# EAGLE design PCB-MicroKP01 (EAGLE 7.7.0)

## Sheet 1 of 2
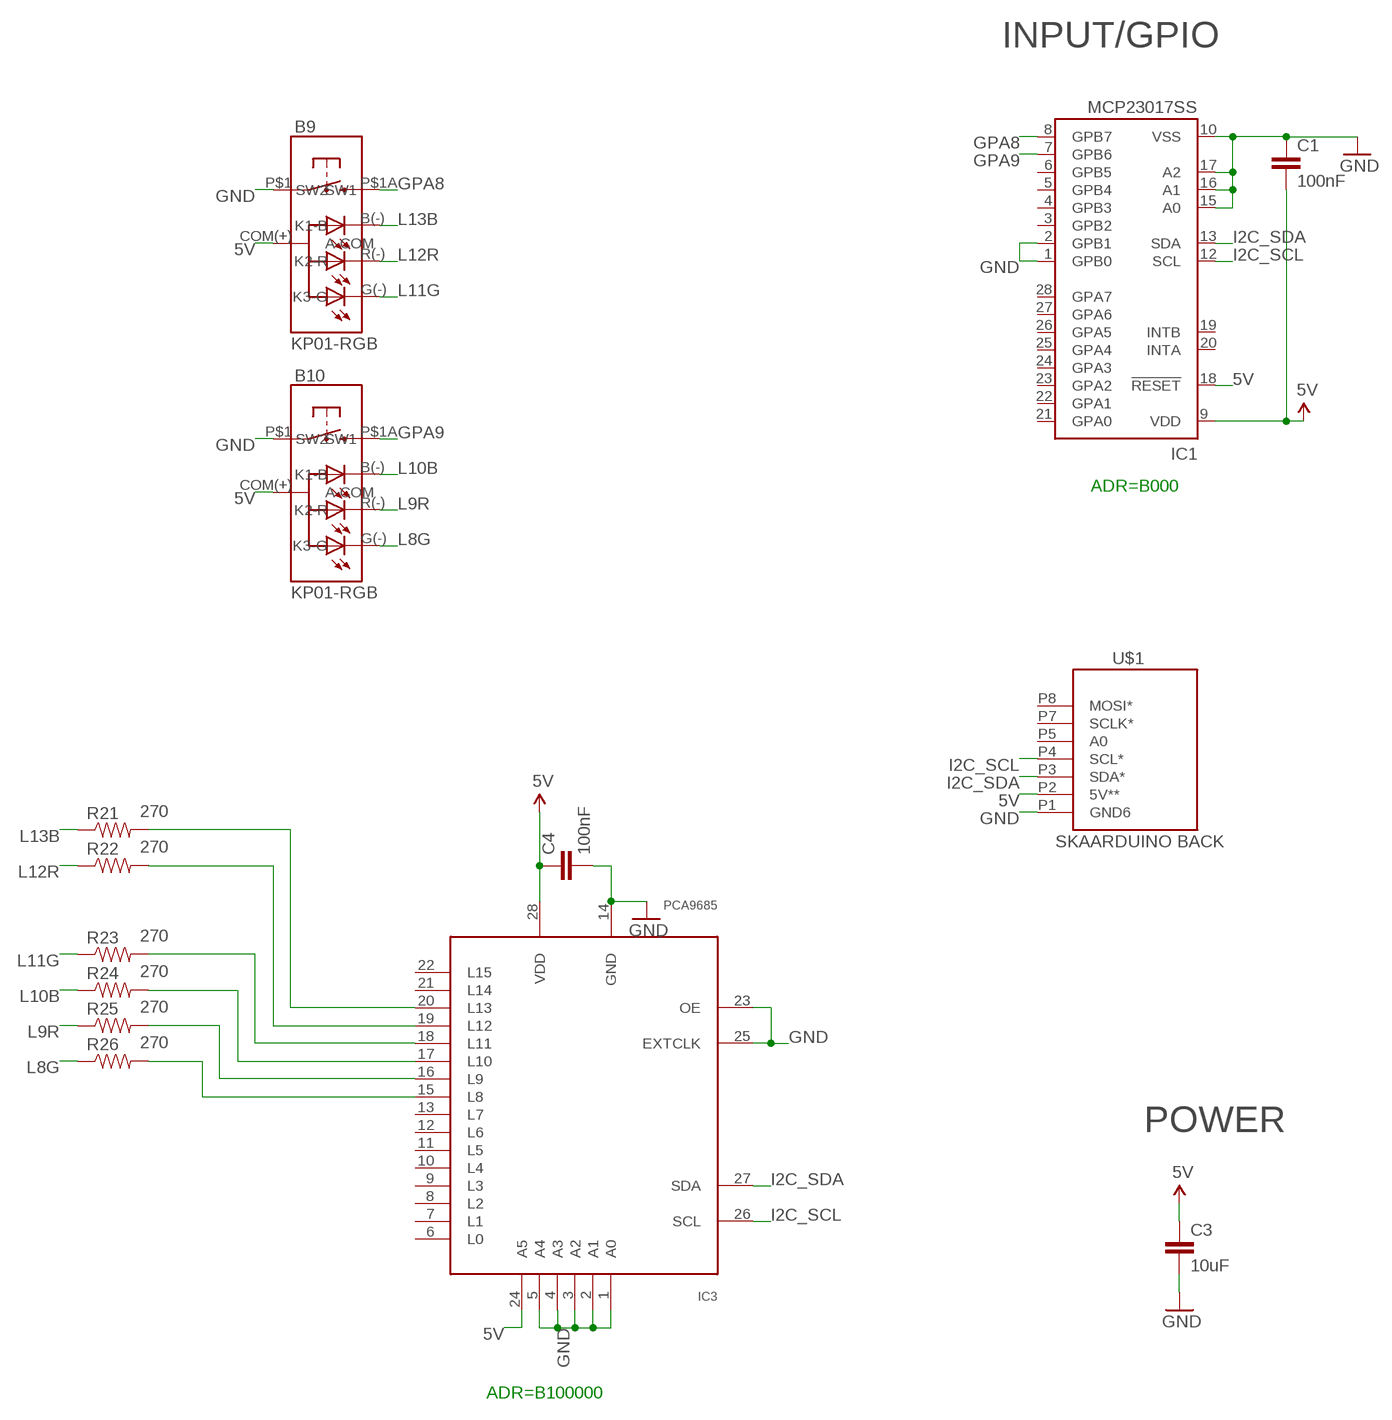
[diagram p0: schematic, sheet 1]

### Parts
B9  KP01-RGB  NKK-KP01  [NKK-KP01]
B10  KP01-RGB  NKK-KP01  [NKK-KP01]
C1  100nF  CAP0603-CAP  [0603-CAP]
C3  10uF  CAP0805  [0805]
C4  100nF  CAP0603-CAP  [0603-CAP]
IC1  MCP23017SS  [SSOP28]
IC3  PCA9685  [TSSOP28]
R21  270  RESISTOR0603-RES  [0603-RES]
R22  270  RESISTOR0603-RES  [0603-RES]
R23  270  RESISTOR0603-RES  [0603-RES]
R24  270  RESISTOR0603-RES  [0603-RES]
R25  270  RESISTOR0603-RES  [0603-RES]
R26  270  RESISTOR0603-RES  [0603-RES]
U$1  SKAARDUINO_BACK_SERIAL  [SKAARDUINO_BACK_PTH_SERIAL]

### Nets
5V [Power]: B9.COM(+)(A-COM) B10.COM(+)(A-COM) C1.2 C3.1 C4.1 IC1.9(VDD) IC1.18(!RESET) IC3.24(A5) IC3.28(VDD) U$1.P2(5V**)
GND [Power]: B9.P$1(SW1) B10.P$1(SW1) C1.1 C3.2 C4.2 IC1.1(GPB0) IC1.2(GPB1) IC1.10(VSS) IC1.15(A0) IC1.16(A1) IC1.17(A2) IC3.1(A0) IC3.2(A1) IC3.3(A2) IC3.4(A3) IC3.5(A4) IC3.14(GND) IC3.23(OE) IC3.25(EXTCLK) U$1.P1(GND6)
GPA8: B9.P$1A(SW2) IC1.8(GPB7)
GPA9: B10.P$1A(SW2) IC1.7(GPB6)
I2C_SCL: IC1.12(SCL) IC3.26(SCL) U$1.P4(SCL*)
I2C_SDA: IC1.13(SDA) IC3.27(SDA) U$1.P3(SDA*)
L8G: B10.G(-)(K3-G) R26.1
L9R: B10.R(-)(K2-R) R25.1
L10B: B10.B(-)(K1-B) R24.1
L11G: B9.G(-)(K3-G) R23.1
L12R: B9.R(-)(K2-R) R22.1
L13B: B9.B(-)(K1-B) R21.1
N$18: IC3.15(L8) R26.2
N$28: IC3.16(L9) R25.2
N$29: IC3.17(L10) R24.2
N$30: IC3.18(L11) R23.2
N$31: IC3.19(L12) R22.2
N$32: IC3.20(L13) R21.2
Unconnected: IC1.3(GPB2) IC1.4(GPB3) IC1.5(GPB4) IC1.6(GPB5) IC1.19(INTB) IC1.20(INTA) IC1.21(GPA0) IC1.22(GPA1) IC1.23(GPA2) IC1.24(GPA3) IC1.25(GPA4) IC1.26(GPA5) IC1.27(GPA6) IC1.28(GPA7) IC3.6(L0) IC3.7(L1) IC3.8(L2) IC3.9(L3) IC3.10(L4) IC3.11(L5) IC3.12(L6) IC3.13(L7) IC3.21(L14) IC3.22(L15) U$1.P5(A0) U$1.P7(SCLK*) U$1.P8(MOSI*)

### Notes on the sheet
- INPUT/GPIO
- ADR=B000
- POWER
- ADR=B100000

## Sheet 2 of 2

## Library data of the parts
B9 B10 = SKAARHOJ:NKK-KP01: NKK-KP01-15AC 100mA12VDC
C1 C3 C4 = SparkFun:CAP: Capacitor Standard 0603 ceramic capacitor, and 0.1" leaded capacitor.
IC1 = microchip:MCP23017: http://ww1.microchip.com/downloads/en/DeviceDoc/21952a.pdf Source: http://ww1.microchip.com/downloads/en/DeviceDoc/21952a.pdf; MF: MICROCHIP; MPN: MCP23017-E/SS; OC_FARNELL: 1467674; OC_NEWARK: 31K2960
IC3 = wsmith:PCA9685
R21-R26 = SparkFun:RESISTOR: Resistor Basic schematic elements and footprints for 0603, 1206, and PTH resistors.
U$1 = SKAARHOJ:SKAARDUINO_BACK_SERIAL

## Net classes
0 default: width 0.203 mm, drill 0.254 mm, clearance 0.203 mm
1 Power: width 0.305 mm, drill 0.406 mm, clearance 0.254 mm

## Board
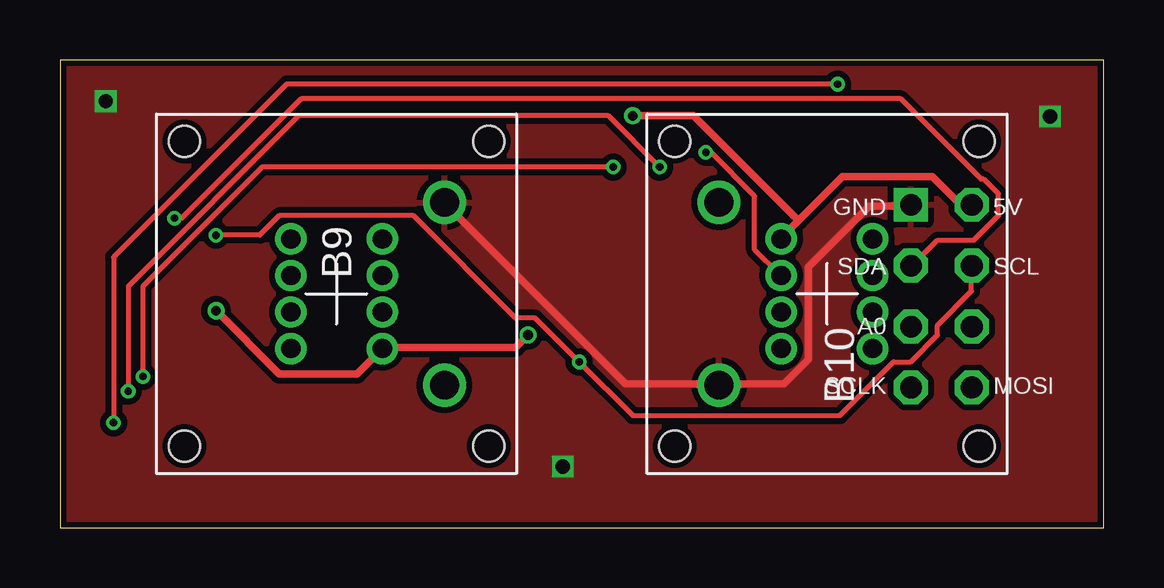
[diagram p1: board, top side]
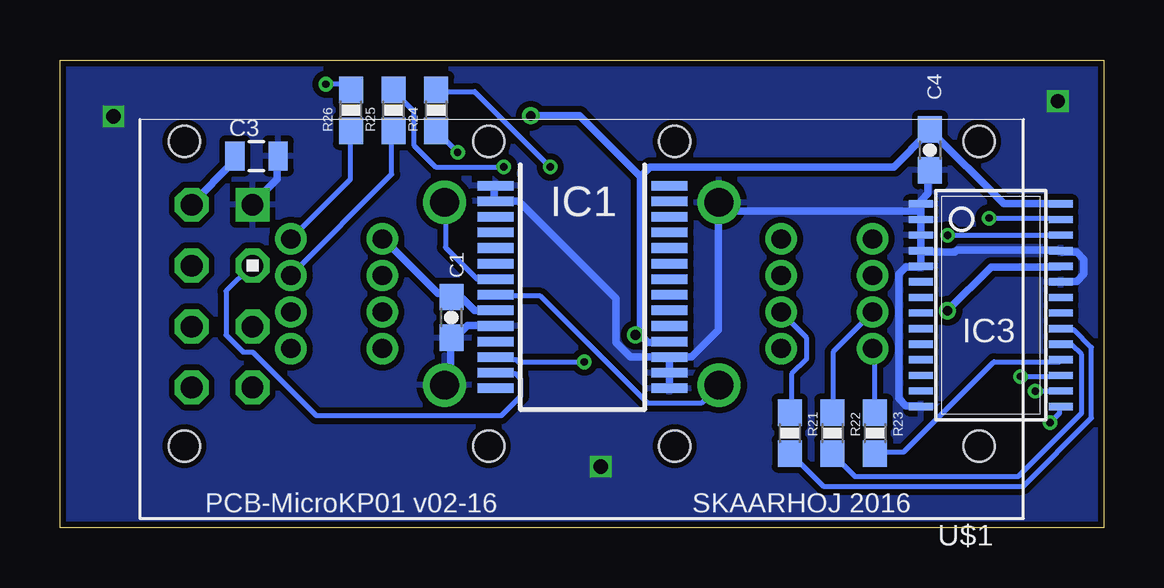
[diagram p2: board, bottom side, seen from below]

Size 43.5 x 19.5 mm. Coordinates in mm from the lower left corner, seen from the top.
Outline: 0,0 43.5,0 43.5,19.5 0,19.5 0,0
Copper layers (1*16): Top 0.035mm / dielectric 1.5mm / Bottom 0.035mm
Design rules "Fusion_eagle_rule_v1.1": minimum track width 6mil, minimum drill 12mil, track to track 6mil, track to pad 6mil, pad to pad 6mil, via to via 6mil, smd to smd 0mil, copper to edge 10mil, drill to drill 10mil, minimum pad ring 10mil, minimum via ring 6mil, stop-mask expansion 2mil, vias tented up to drill 100mil, thermal gap 10mil

### Footprints (pad centres in the part's own frame; a part is rotated, then mirrored left to right if it is on the bottom)
NKK-KP01 = drill 0.8: B(-) 1.905,-0.762; COM(+) 1.905,-2.286; G(-) -1.905,-2.286; P$3 1.905,0.762; P$4 1.905,2.286; P$7 -1.905,0.762; P$8 -1.905,2.286; R(-) -1.905,-0.762 | drill 1.2: P$1 4.496,3.81; P$1A 4.496,-3.81 | hole 1.3: -6.35,6.35; 6.35,6.35; 6.35,-6.35; -6.35,-6.35
0603-CAP = smd 1.1 x 1: 1 -0.85,0; 2 0.85,0
0805 = smd 0.8 x 1.2: 1 -0.9,0; 2 0.9,0
SSOP28 = smd 0.4 x 1.5: 1 -4.225,-3.625; 2 -3.575,-3.625; 3 -2.925,-3.625; 4 -2.275,-3.625; 5 -1.625,-3.625; 6 -0.975,-3.625; 7 -0.325,-3.625; 8 0.325,-3.625; 9 0.975,-3.625; 10 1.625,-3.625; 11 2.275,-3.625; 12 2.925,-3.625; 13 3.575,-3.625; 14 4.225,-3.625; 15 4.225,3.625; 16 3.575,3.625; 17 2.925,3.625; 18 2.275,3.625; 19 1.625,3.625; 20 0.975,3.625; 21 0.325,3.625; 22 -0.325,3.625; 23 -0.975,3.625; 24 -1.625,3.625; 25 -2.275,3.625; 26 -2.925,3.625; 27 -3.575,3.625; 28 -4.225,3.625
TSSOP28 = smd 0.305 x 0.991: 1 -4.225,-2.918; 2 -3.575,-2.918; 3 -2.925,-2.918; 4 -2.275,-2.918; 5 -1.625,-2.918; 6 -0.975,-2.918; 7 -0.325,-2.918; 8 0.325,-2.918; 9 0.975,-2.918; 10 1.625,-2.918; 11 2.275,-2.918; 12 2.925,-2.918; 13 3.575,-2.918; 14 4.225,-2.918; 15 4.225,2.918; 16 3.575,2.918; 17 2.925,2.918; 18 2.275,2.918; 19 1.625,2.918; 20 0.975,2.918; 21 0.325,2.918; 22 -0.325,2.918; 23 -0.975,2.918; 24 -1.625,2.918; 25 -2.275,2.918; 26 -2.925,2.918; 27 -3.575,2.918; 28 -4.225,2.918
0603-RES = smd 1.1 x 1: 1 -0.85,0; 2 0.85,0
SKAARDUINO_BACK_PTH_SERIAL = drill 0.9 square: P1 13.97,32.131 | drill 0.9 octagon: P2 13.97,34.671; P3 11.43,32.131; P4 11.43,34.671; P5 8.89,32.131; P6 8.89,34.671; P7 6.35,32.131; P8 6.35,34.671

### Placement (x,y rotation side)
B9  11.53,9.75 0 top
B10  31.97,9.75 180 top
C1  27.18,8.76 90 bottom
C3  35.31,15.49 0 bottom
C4  7.24,15.75 270 bottom
IC1  21.72,10.03 270 bottom
IC3  4.7,9.27 270 bottom
R21  13.08,3.94 270 bottom
R22  11.3,3.94 270 bottom
R23  9.53,3.94 270 bottom
R24  27.81,17.4 90 bottom
R25  29.59,17.4 90 bottom
R26  31.37,17.4 90 bottom
U$1  3.34,-0.51 90 bottom

### Tracks (layer width: path | path; a pad name or v marks a point on that pad's centre or on a via)
5V  (via drill 0.41)
  Top 0.305: 30.79,12.8 30.07,12.09 B10.COM(+) | 30.79,12.8 32.61,14.63 36.37,14.63 37.49,13.51 38,13.51 U$1.P2 | v6.5,9.04 9.14,6.4 12.39,6.4 13.41,7.42 B9.COM(+) 13.51,7.52 19,7.52 v19.51,8.03 | 30.79,12.8 26.42,17.17 v23.88,17.17
  Bottom 0.305: C3.1 36.27,15.44 36.27,15.24 38,13.51 U$1.P2 | IC1.9 25.4,9.04 26.21,9.04 26.72,9.55 27.13,9.55 C1.2 27.23,9.75 27.74,9.75 29.97,11.99 B10.COM(+) | v6.5,9.04 4.67,10.87 1.83,10.87 IC3.24 | IC3.28 1.83,13.51 4.17,13.51 7.21,16.56 C4.1 7.32,16.46 8.74,15.04 18.9,15.04 19.3,14.63 | 19.3,8.03 19,7.72 18.19,7.72 IC1.18 | 19.3,14.63 19.3,8.03 | v19.51,8.03 19.3,8.03 | v23.88,17.17 21.84,17.17 19.3,14.63
GND  (via drill 0.6)
  Top 0.305: U$1.P1 35.46,13.41 33.73,13.41 31.19,10.87 31.19,7.01 30.18,5.99 27.53,5.99 B10.P$1 27.33,5.99 23.57,5.99 16.05,13.51 B9.P$1
  Bottom 0.305: C3.2 34.44,15.44 34.44,14.53 35.46,13.51 U$1.P1 | B10.P$1 27.43,5.99 27.23,6.2 27.23,7.82 C1.1 27.03,7.92 26.52,8.43 25.4,8.43 IC1.10 | IC3.23 1.73,10.26 1.12,10.26 0.81,10.57 0.81,11.18 1.12,11.48 1.73,11.48 IC3.25 1.93,11.58 6.1,11.58 6.2,11.48 7.52,11.48 IC3.4 | IC3.14 7.62,5.08 8.23,5.08 8.53,5.38 8.53,10.57 8.23,10.87 7.62,10.87 IC3.5 7.62,10.97 7.62,11.48 IC3.4 | IC3.4 7.62,11.68 IC3.3 7.62,12.29 7.62,12.8 IC3.2 7.62,12.9 7.62,13.21 | 7.62,13.21 7.62,13.41 IC3.1 7.62,13.61 7.32,13.92 7.32,14.83 C4.2 | IC1.1 25.4,14.22 25.4,13.61 IC1.2 25.2,13.61 24.38,13.61 20.32,9.55 20.32,7.72 19.71,7.11 18.19,7.11 IC1.17 | IC1.15 18.09,5.89 18.09,6.4 IC1.16 18.09,6.6 18.09,7.01 IC1.17 | IC1.17 17.98,7.11 17.17,7.11 16.05,8.23 16.05,13.51 B9.P$1 15.95,13.21 7.62,13.21
  other vias: 20.95,2.54 1.91,17.78 41.27,17.14
  pour Top: 0,0 43.81,0 43.81,19.68 0,19.68
  pour Bottom: 0,0 43.81,0 43.81,19.68 0,19.68
GPA8
  Bottom 0.203: IC1.8 25.3,9.65 23.47,9.65 19,5.18 16.76,5.18 16.05,5.89 B9.P$1A
GPA9
  Bottom 0.203: IC1.7 25.4,10.36 26.11,10.36 27.43,11.68 27.43,13.51 B10.P$1A
I2C_SCL  (via drill 0.3)
  Top 0.203: v6.5,12.19 8.33,12.19 9.14,13.01 14.73,13.01 19,8.74 19.81,8.74 v21.64,6.91 23.88,4.67 32.51,4.67 34.75,6.91 35.46,6.91 36.58,8.03 36.58,8.43 38,9.86 38,10.87 U$1.P4
  Bottom 0.203: v6.5,12.19 1.83,12.19 IC3.26 | v21.64,6.91 24.38,6.91 24.49,7.01 25.3,7.01 IC1.12
I2C_SDA  (via drill 0.3)
  Top 0.203: v4.78,12.9 5.08,12.9 10.06,17.88 35.05,17.88 38.41,14.53 38.51,14.53 39.12,13.92 39.12,13.01 38.1,11.99 36.58,11.99 35.56,10.97 U$1.P3
  Bottom 0.203: v4.78,12.9 1.83,12.9 IC3.27 | IC1.13 25.3,6.4 24.49,6.4 24.28,6.2 24.28,5.49 25.09,4.67 32.82,4.67 35.46,7.32 35.87,7.32 36.58,8.03 36.58,9.86 35.56,10.87 U$1.P3
L8G
  Bottom 0.203: R26.1 31.39,16.46 31.39,14.53 33.83,12.09 B10.G(-)
L9R
  Bottom 0.203: R25.1 29.67,16.46 29.67,14.73 33.83,10.57 B10.R(-)
L10B  (via drill 0.3)
  Top 0.203: v26.92,15.65 27.13,15.65 28.96,13.82 28.96,11.58 29.97,10.57 B10.B(-)
  Bottom 0.203: v26.92,15.65 27.74,16.46 R24.1
L11G
  Bottom 0.203: R23.1 9.55,4.88 9.55,7.42 B9.G(-)
L12R
  Bottom 0.203: R22.1 11.28,4.88 11.28,7.32 9.65,8.94 B9.R(-)
L13B
  Bottom 0.203: R21.1 13.01,4.88 13.01,6.4 12.39,7.01 12.39,7.92 13.41,8.94 B9.B(-)
N$18  (via drill 0.3)
  Top 0.203: v2.23,4.37 2.23,11.28 9.45,18.49 v32.41,18.49
  Bottom 0.203: v2.23,4.37 1.83,4.78 1.83,4.98 IC3.15 | v32.41,18.49 31.6,18.49 31.39,18.29 R26.2
N$28  (via drill 0.3)
  Top 0.203: v2.85,5.69 2.85,10.06 9.96,17.17 22.86,17.17 v24.99,15.04
  Bottom 0.203: v2.85,5.69 1.83,5.69 IC3.16 | v24.99,15.04 27.84,15.04 28.75,15.95 28.75,17.37 29.57,18.19 R25.2
N$29  (via drill 0.3)
  Top 0.203: v3.45,6.3 3.45,10.06 8.43,15.04 v23.06,15.04
  Bottom 0.203: v3.45,6.3 1.83,6.3 IC3.17 | v23.06,15.04 26.21,18.19 27.74,18.19 R24.2
N$30
  Bottom 0.203: IC3.18 1.83,6.91 4.57,6.91 8.33,3.15 9.45,3.15 R23.2
N$31
  Bottom 0.203: IC3.19 1.73,7.62 1.32,7.62 0.91,7.21 0.91,4.78 3.56,2.13 10.36,2.13 11.28,3.05 R22.2
N$32
  Bottom 0.203: IC3.20 1.73,8.23 1.22,8.23 0.51,7.52 0.51,4.57 3.35,1.73 11.68,1.73 13.01,3.05 R21.2

### Text on the board
_bsilk: SKAARHOJ 2016 | PCB-MicroKP01 v02-16